# Altium schematic sheet Tunguska.SchDoc: Project Tunguska - Main Sheet
size A4; DrawnBy: A. Küllenberg; Revision: A; SheetNumber: 2; SheetTotal: 10
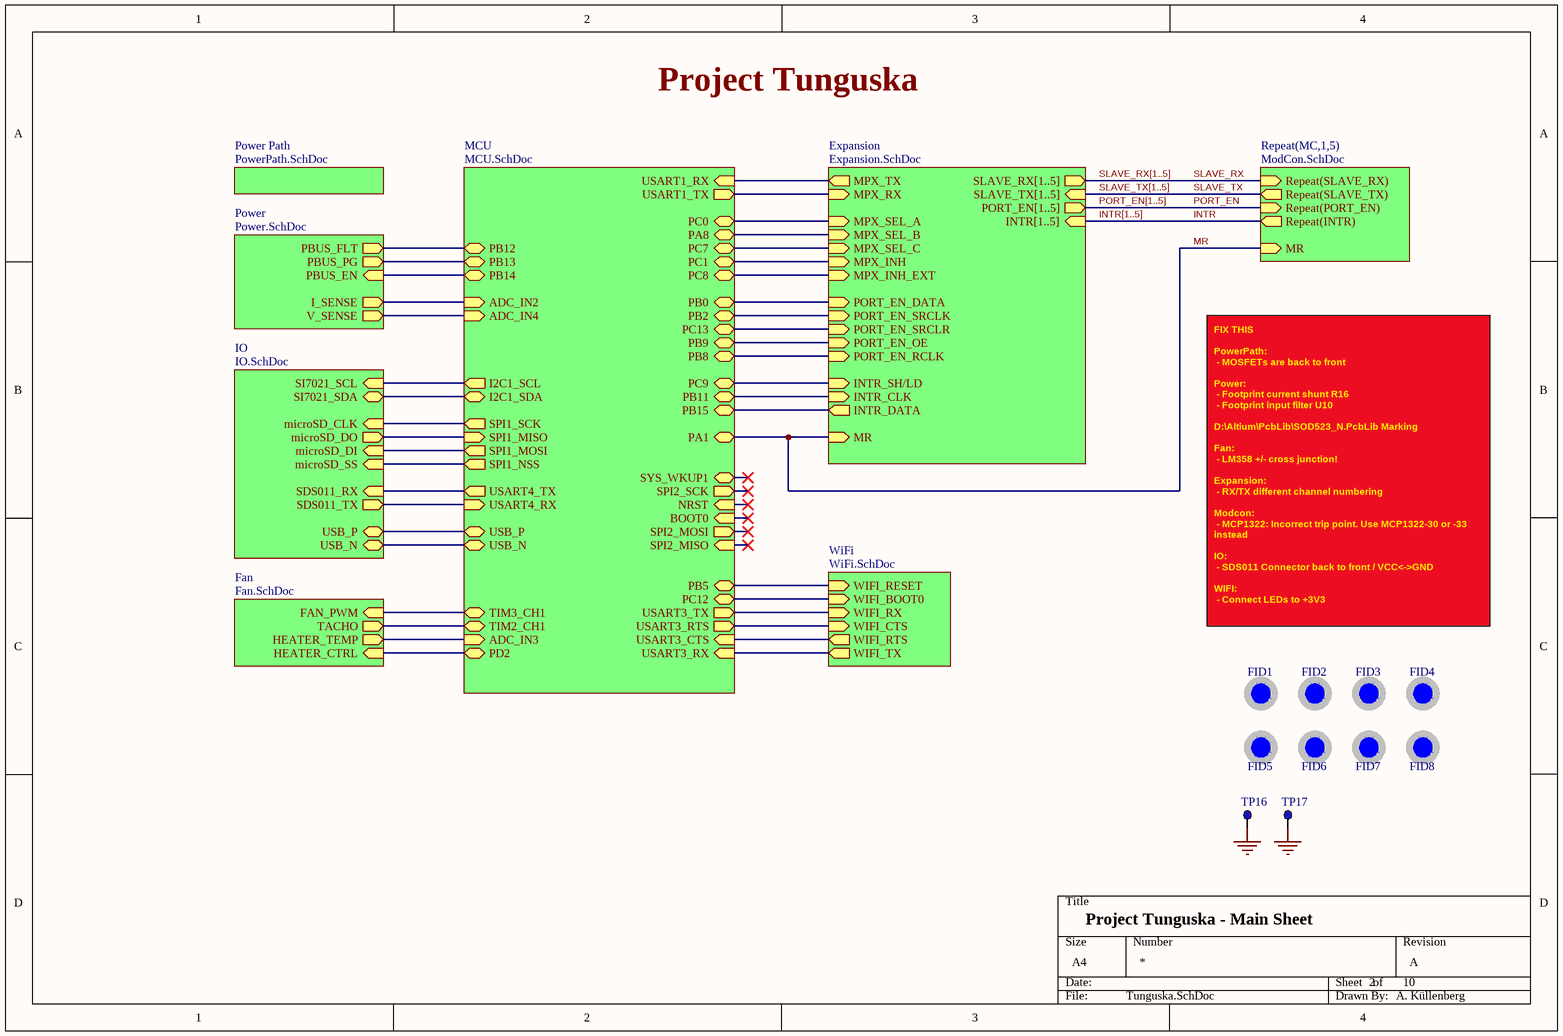
[diagram p0: Tunguska.SchDoc]

## Parts
FID1  Standard  [Fiducial_40_120mil]  (value not drawn)  (no BOM)
FID2  Standard  [Fiducial_40_120mil]  (value not drawn)  (no BOM)
FID3  Standard  [Fiducial_40_120mil]  (value not drawn)  (no BOM)
FID4  Standard  [Fiducial_40_120mil]  (value not drawn)  (no BOM)
FID5  Standard  [Fiducial_40_120mil]  (value not drawn)  (no BOM)
FID6  Standard  [Fiducial_40_120mil]  (value not drawn)  (no BOM)
FID7  Standard  [Fiducial_40_120mil]  (value not drawn)  (no BOM)
FID8  Standard  [Fiducial_40_120mil]  (value not drawn)  (no BOM)
TP16  TP  [TP_TH]  (value not drawn)
TP17  TP  [TP_TH]  (value not drawn)

## Sub-sheets
Expansion = Expansion.SchDoc: MPX_SEL_A (in), MPX_SEL_B (in), SLAVE_RX[1..5] (out), INTR[1..5] (in), SLAVE_TX[1..5] (in), MPX_SEL_C (in), MPX_INH (in), MPX_TX (out), MPX_RX (in), PORT_EN_DATA (in), PORT_EN_SRCLK (in), PORT_EN_SRCLR (in), INTR_SH/LD (in), PORT_EN_OE (in), PORT_EN_RCLK (in), INTR_CLK (in), MPX_INH_EXT (in), MR (in), INTR_DATA (out), PORT_EN[1..5] (out)
Fan = Fan.SchDoc: FAN_PWM (in), TACHO (out), HEATER_TEMP (out), HEATER_CTRL (in)
IO = IO.SchDoc: microSD_SS (in), SI7021_SDA (bidir), microSD_CLK (in), microSD_DO (out), microSD_DI (in), SI7021_SCL (in), SDS011_RX (in), SDS011_TX (out), USB_P (bidir), USB_N (bidir)
MCU = MCU.SchDoc: I2C1_SCL (out), I2C1_SDA (bidir), USART1_RX (in), ADC_IN2 (in), USB_N (bidir), USB_P (bidir), TIM2_CH1 (bidir), USART1_TX (out), USART3_CTS (in), ADC_IN3 (in), USART3_RTS (out), PB14 (bidir), USART3_TX (out), USART3_RX (in), TIM3_CH1 (bidir), USART4_TX (out), USART4_RX (in), PA1 (bidir), ADC_IN4 (in), SPI1_MOSI (out), PA8 (bidir), SPI1_NSS (out), PB0 (bidir), PB2 (bidir), SPI1_SCK (out), SPI1_MISO (in), PB5 (bidir), PB8 (bidir), PB9 (bidir), PB11 (bidir), PB12 (bidir), PB13 (bidir), PB15 (bidir), PC0 (bidir), PC1 (bidir), PC7 (bidir), PC8 (bidir), PC9 (bidir), PC12 (bidir), PC13 (bidir), PD2 (bidir), SYS_WKUP1 (bidir), SPI2_SCK (out), NRST (in), BOOT0 (in), SPI2_MOSI (out), SPI2_MISO (in)
Power = Power.SchDoc: I_SENSE (out), PBUS_EN (in), PBUS_PG (out), PBUS_FLT (out), V_SENSE (out)
Power Path = PowerPath.SchDoc: no entries
Repeat(MC,1,5) = ModCon.SchDoc: Repeat(SLAVE_RX) (in), Repeat(PORT_EN) (in), MR (in), Repeat(SLAVE_TX) (out), Repeat(INTR) (out)
WiFi = WiFi.SchDoc: WIFI_RESET (in), WIFI_BOOT0 (in), WIFI_RX (in), WIFI_CTS (in), WIFI_RTS (out), WIFI_TX (out)

## Nets
GND: TP16.1 TP17.1
INTR: sheet Repeat(MC,1,5)/Repeat(INTR)
MR: sheet Repeat(MC,1,5)/MR, sheet Expansion/MR, sheet MCU/PA1
PORT_EN: sheet Repeat(MC,1,5)/Repeat(PORT_EN)
SLAVE_RX: sheet Repeat(MC,1,5)/Repeat(SLAVE_RX)
SLAVE_TX: sheet Repeat(MC,1,5)/Repeat(SLAVE_TX)
(unnamed): sheet Power/I_SENSE, sheet MCU/ADC_IN2
(unnamed): sheet Power/PBUS_EN, sheet MCU/PB14
(unnamed): sheet Power/PBUS_PG, sheet MCU/PB13
(unnamed): sheet Power/PBUS_FLT, sheet MCU/PB12
(unnamed): sheet Power/V_SENSE, sheet MCU/ADC_IN4
(unnamed): sheet IO/microSD_SS, sheet MCU/SPI1_NSS
(unnamed): sheet IO/SI7021_SDA, sheet MCU/I2C1_SDA
(unnamed): sheet IO/microSD_CLK, sheet MCU/SPI1_SCK
(unnamed): sheet IO/microSD_DO, sheet MCU/SPI1_MISO
(unnamed): sheet IO/microSD_DI, sheet MCU/SPI1_MOSI
(unnamed): sheet IO/SI7021_SCL, sheet MCU/I2C1_SCL
(unnamed): sheet IO/SDS011_RX, sheet MCU/USART4_TX
(unnamed): sheet IO/SDS011_TX, sheet MCU/USART4_RX
(unnamed): sheet IO/USB_P, sheet MCU/USB_P
(unnamed): sheet IO/USB_N, sheet MCU/USB_N
(unnamed): sheet Fan/FAN_PWM, sheet MCU/TIM3_CH1
(unnamed): sheet Fan/TACHO, sheet MCU/TIM2_CH1
(unnamed): sheet Fan/HEATER_TEMP, sheet MCU/ADC_IN3
(unnamed): sheet Fan/HEATER_CTRL, sheet MCU/PD2
(unnamed): sheet WiFi/WIFI_RESET, sheet MCU/PB5
(unnamed): sheet WiFi/WIFI_BOOT0, sheet MCU/PC12
(unnamed): sheet WiFi/WIFI_RX, sheet MCU/USART3_TX
(unnamed): sheet WiFi/WIFI_CTS, sheet MCU/USART3_RTS
(unnamed): sheet WiFi/WIFI_RTS, sheet MCU/USART3_CTS
(unnamed): sheet WiFi/WIFI_TX, sheet MCU/USART3_RX
(unnamed): sheet Expansion/MPX_SEL_A, sheet MCU/PC0
(unnamed): sheet Expansion/MPX_SEL_B, sheet MCU/PA8
(unnamed): sheet Expansion/MPX_SEL_C, sheet MCU/PC7
(unnamed): sheet Expansion/MPX_INH, sheet MCU/PC1
(unnamed): sheet Expansion/MPX_TX, sheet MCU/USART1_RX
(unnamed): sheet Expansion/MPX_RX, sheet MCU/USART1_TX
(unnamed): sheet Expansion/PORT_EN_DATA, sheet MCU/PB0
(unnamed): sheet Expansion/PORT_EN_SRCLK, sheet MCU/PB2
(unnamed): sheet Expansion/PORT_EN_SRCLR, sheet MCU/PC13
(unnamed): sheet Expansion/INTR_SH/LD, sheet MCU/PC9
(unnamed): sheet Expansion/PORT_EN_OE, sheet MCU/PB9
(unnamed): sheet Expansion/PORT_EN_RCLK, sheet MCU/PB8
(unnamed): sheet Expansion/INTR_CLK, sheet MCU/PB11
(unnamed): sheet Expansion/MPX_INH_EXT, sheet MCU/PC8
(unnamed): sheet Expansion/INTR_DATA, sheet MCU/PB15

## Buses and harness runs
bus INTR[1..5] = sheet Expansion/INTR[1..5]
bus PORT_EN[1..5] = sheet Expansion/PORT_EN[1..5]
bus SLAVE_RX[1..5] = sheet Expansion/SLAVE_RX[1..5]
bus SLAVE_TX[1..5] = sheet Expansion/SLAVE_TX[1..5]

## Notes on the sheet
- Project Tunguska
- FIX THIS
  PowerPath:
  - MOSFETs are back to front
  Power:
  - Footprint current shunt R16
  - Footprint input filter U10
  D:\Altium\PcbLib\SOD523_N.PcbLib Marking
  Fan:
  - LM358 +/- cross junction!
  Expansion:
  - RX/TX different channel numbering
  Modcon:
  - MCP1322: Incorrect trip point. Use MCP1322-30 or -33 instead
  IO:
  - SDS011 Connector back to front / VCC<->GND
  WIFI:
  - Connect LEDs to +3V3

## Library data of the parts
FID1-FID8 = Fiducial 40/120mil: Part Number: Fiducial 40/120mil; Value: Standard
TP16 TP17 = 5001: TEST POINT PC MINI .040"D BLACK; Part Number: 5001; Manufacturer: Keystone Electronics; Plating: Silver; Material - Insulation: Nylon 46, UL 94V-0; Material - Body: Phosphor Bronze; Value: TP; Supplier 1: Digi-Key; Supplier Part Number 1: 36-5001-ND; Manufacturer Part Number: 5001; RoHS: RoHS Compliant; Category: Test and Measurement; Stock 1: 874701; Pricing 1: 1=0.37, 10=0.319, 50=0.2322, 100=0.2231, 250=0.20032, 500=0.19122, 1000=0.16322, 2500=0.14568, 5000=0.13658 (EUR); Part Status: Active; Mounting Type: 0.040" (1.02mm) Hole Diameter; ComponentLink1URL: http://www.keyelco.com/product-pdf.cfm?p=1310; ComponentLink1Description: http://www.keyelco.com/product-pdf.cfm?p=1310; Packaging: Bulk; Type: PC Test Point, Miniature; Color: Black; Size / Dimension: 0.100" Dia x 0.180" L (2.54mm x 4.57mm); Height: -